# EAGLE design xcodec_CS42526_A (EAGLE 8.2.0)
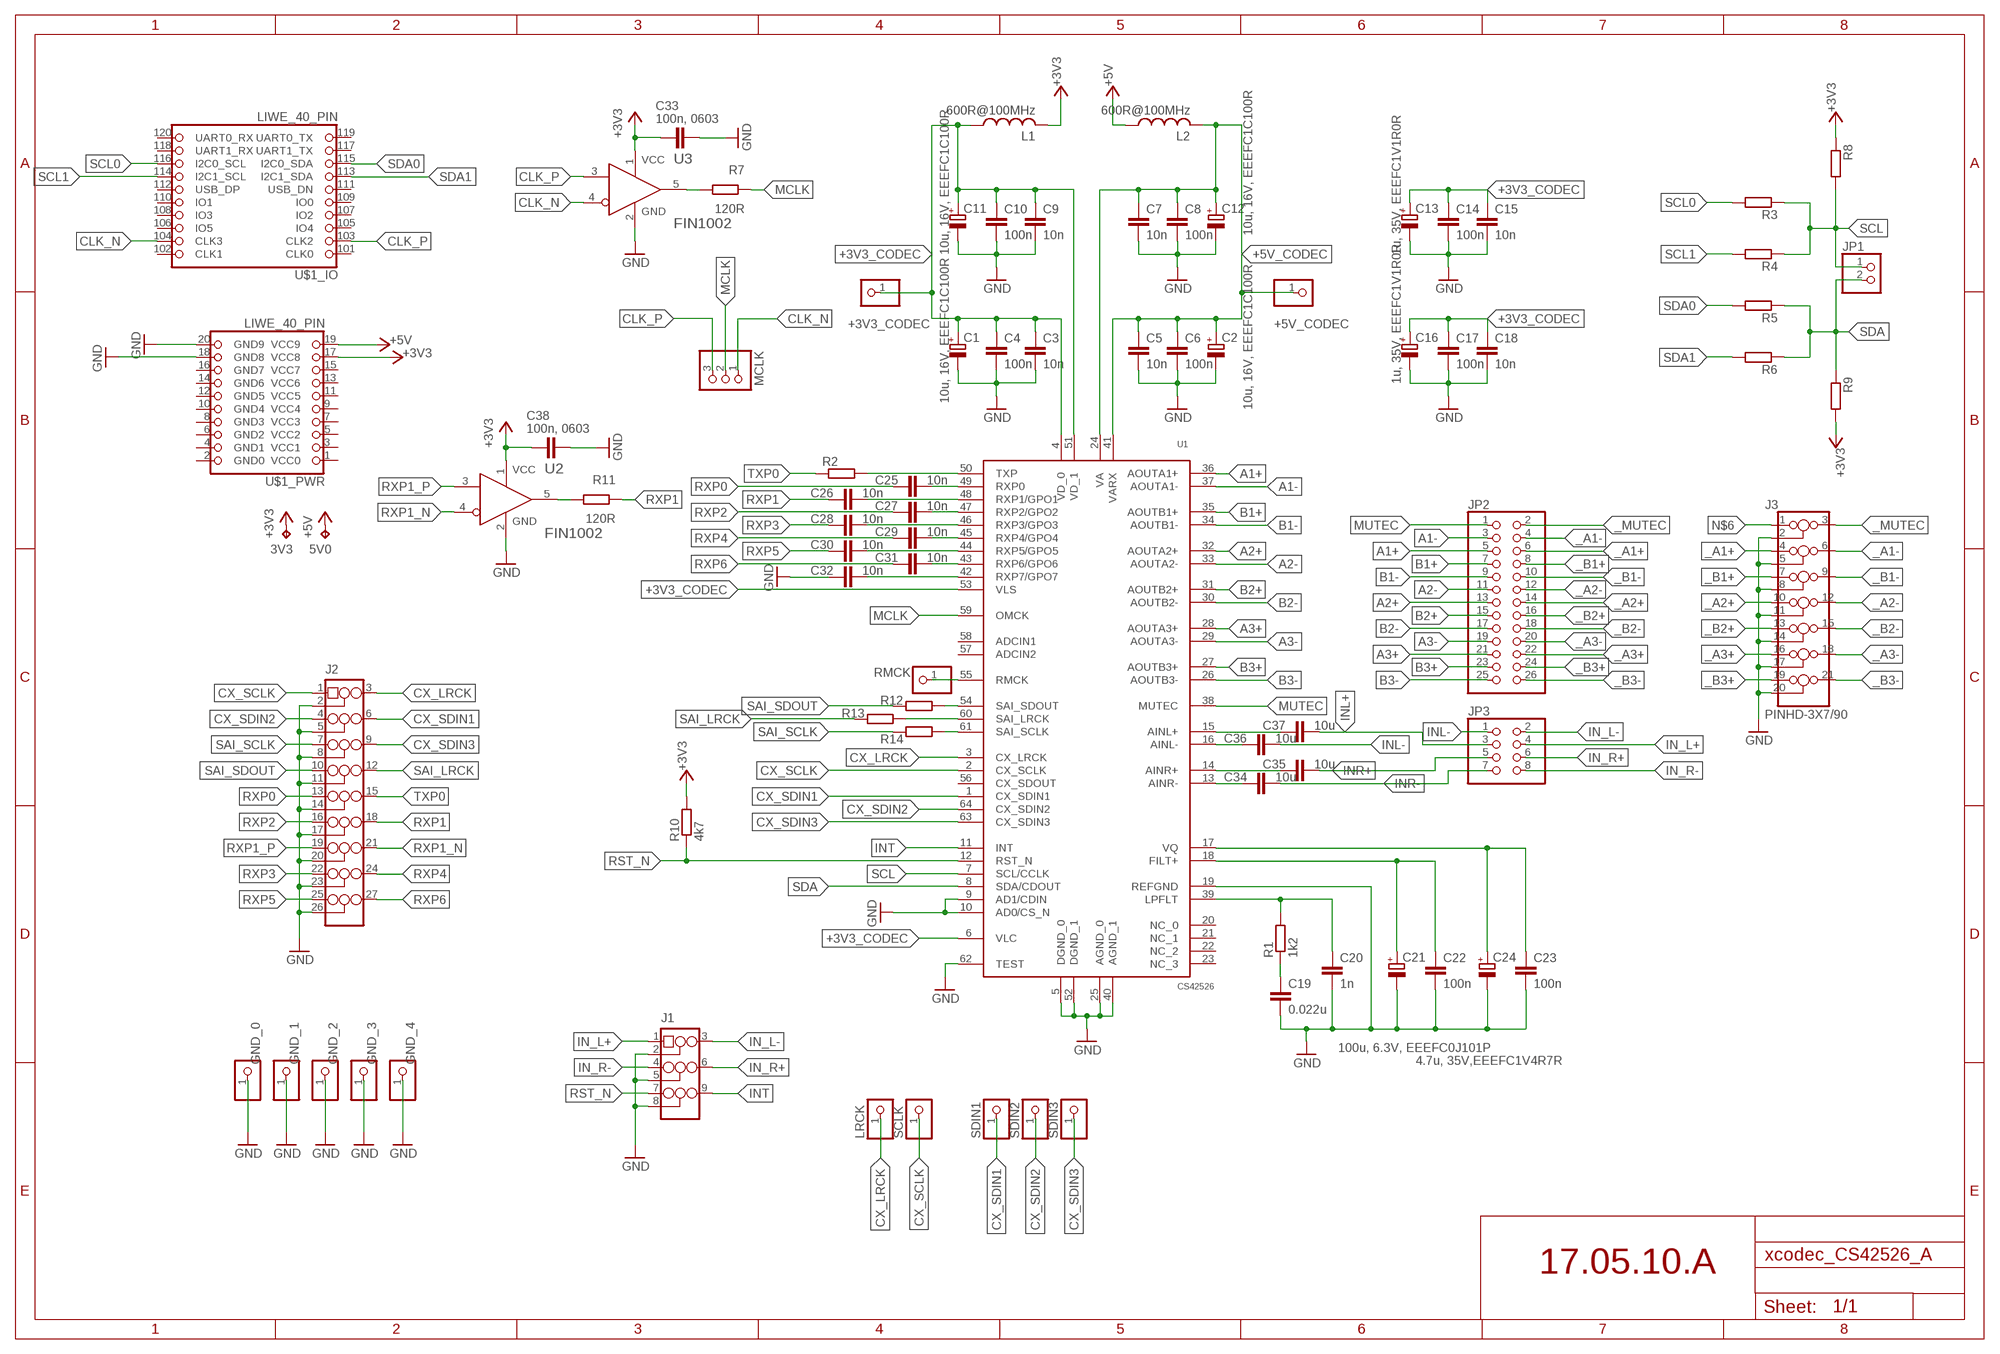
[diagram p0: schematic, sheet 1]

## Parts
3V3  TPTP14R  [TP14R]
5V0  TPTP14R  [TP14R]
+3V3_CODEC  PINHD-1X1  [1X01]
+5V_CODEC  PINHD-1X1  [1X01]
C1  10u, 16V, EEEFC1C100R  C-POL_B  [EEE-FC1V1R0AR]
C2  10u, 16V, EEEFC1C100R  C-POL_B  [EEE-FC1V1R0AR]
C3  10n  C-EUC0603K  [C0603K]
C4  100n  C-EUC0603K  [C0603K]
C5  10n  C-EUC0603K  [C0603K]
C6  100n  C-EUC0603K  [C0603K]
C7  10n  C-EUC0603K  [C0603K]
C8  100n  C-EUC0603K  [C0603K]
C9  10n  C-EUC0603K  [C0603K]
C10  100n  C-EUC0603K  [C0603K]
C11  10u, 16V, EEEFC1C100R  C-POL_B  [EEE-FC1V1R0AR]
C12  10u, 16V, EEEFC1C100R  C-POL_B  [EEE-FC1V1R0AR]
C13  1u, 35V, EEEFC1V1R0R  C-POL_B  [EEE-FC1V1R0AR]
C14  100n  C-EUC0603K  [C0603K]
C15  10n  C-EUC0603K  [C0603K]
C16  1u, 35V, EEEFC1V1R0R  C-POL_B  [EEE-FC1V1R0AR]
C17  100n  C-EUC0603K  [C0603K]
C18  10n  C-EUC0603K  [C0603K]
C19  0.022u  C-EUC0603K  [C0603K]
C20  1n  C-EUC0603K  [C0603K]
C21  100u, 6.3V, EEEFC0J101P  C-POL_D  [EEE-FC1V220P]
C22  100n  C-EUC0603K  [C0603K]
C23  100n  C-EUC0603K  [C0603K]
C24  4.7u, 35V,EEEFC1V4R7R  C-POL_B  [EEE-FC1V1R0AR]
C25  10n  C-EUC0603K  [C0603K]
C26  10n  C-EUC0603K  [C0603K]
C27  10n  C-EUC0603K  [C0603K]
C28  10n  C-EUC0603K  [C0603K]
C29  10n  C-EUC0603K  [C0603K]
C30  10n  C-EUC0603K  [C0603K]
C31  10n  C-EUC0603K  [C0603K]
C32  10n  C-EUC0603K  [C0603K]
C33  100n, 0603  C-EUC0603K  [C0603K]
C34  10u  C-EUC0603K  [C0603K]
C35  10u  C-EUC0603K  [C0603K]
C36  10u  C-EUC0603K  [C0603K]
C37  10u  C-EUC0603K  [C0603K]
C38  100n, 0603  C-EUC0603K  [C0603K]
GND_0  PINHD-1X1  [1X01]
GND_1  PINHD-1X1  [1X01]
GND_2  PINHD-1X1  [1X01]
GND_3  PINHD-1X1  [1X01]
GND_4  PINHD-1X1  [1X01]
J1  PINHD-3X3/90  [3X03/90]
J2  PINHD-3X9/90  [3X9/90]
J3  PINHD-3X7/90  [3X07/90]
JP1  PINHD-1X2  [1X02]
JP2  PINHD-2X13  [2X13]
JP3  PINHD-2X4  [2X04]
L1  600R@100MHz  L0603(1608)  [L0603]
L2  600R@100MHz  L0603(1608)  [L0603]
LRCK  PINHD-1X1  [1X01]
MCLK  PINHD-1X3  [1X03]
R1  1k2  R-EU_R0603  [R0603]
R2  R-EU_R0603  [R0603]
R3  R-EU_R0603  [R0603]
R4  R-EU_R0603  [R0603]
R5  R-EU_R0603  [R0603]
R6  R-EU_R0603  [R0603]
R7  120R  R-EU_R0603  [R0603]
R8  R-EU_R0603  [R0603]
R9  R-EU_R0603  [R0603]
R10  4k7  R-EU_R0603  [R0603]
R11  120R  R-EU_R0603  [R0603]
R12  R-EU_R0603  [R0603]
R13  R-EU_R0603  [R0603]
R14  R-EU_R0603  [R0603]
RMCK  PINHD-1X1  [1X01]
SCLK  PINHD-1X1  [1X01]
SDIN1  PINHD-1X1  [1X01]
SDIN2  PINHD-1X1  [1X01]
SDIN3  PINHD-1X1  [1X01]
U1  CS42526  [LQFP_64]
U2  FIN1002  [SOT95P280X140-5N]
U3  FIN1002  [SOT95P280X140-5N]
U$1  LIWE_40_PIN  [LIWE_40_PIN_8X8]

## Nets
+3V3: 3V3.TP C33.2 C38.2 L1.2 R8.1 R9.2 R10.2 U2.1(VCC) U3.1(VCC) U$1.17(_PWR:VCC8)
+3V3_CODEC: +3V3_CODEC.1 C1.1(+) C3.1 C4.1 C9.1 C10.1 C11.1(+) C13.1(+) C14.1 C15.1 C16.1(+) C17.1 C18.1 L1.1 U1.4(VD_0) U1.6(VLC) U1.51(VD_1) U1.53(VLS)
+5V: 5V0.TP L2.1 U$1.19(_PWR:VCC9)
+5V_CODEC: +5V_CODEC.1 C2.1(+) C5.1 C6.1 C7.1 C8.1 C12.1(+) L2.2 U1.24(VA) U1.41(VARX)
_A1+: J3.4 JP2.6
_A1-: J3.6 JP2.4
_A2+: J3.10 JP2.14
_A2-: J3.12 JP2.12
_A3+: J3.16 JP2.22
_A3-: J3.18 JP2.20
_B1+: J3.7 JP2.8
_B1-: J3.9 JP2.10
_B2+: J3.13 JP2.16
_B2-: J3.15 JP2.18
_B3+: J3.19 JP2.24
_B3-: J3.21 JP2.26
_MUTEC: J3.3 JP2.2
A1+: JP2.5 U1.36(AOUTA1+)
A1-: JP2.3 U1.37(AOUTA1-)
A2+: JP2.13 U1.32(AOUTA2+)
A2-: JP2.11 U1.33(AOUTA2-)
A3+: JP2.21 U1.28(AOUTA3+)
A3-: JP2.19 U1.29(AOUTA3-)
B1+: JP2.7 U1.35(AOUTB1+)
B1-: JP2.9 U1.34(AOUTB1-)
B2+: JP2.15 U1.31(AOUTB2+)
B2-: JP2.17 U1.30(AOUTB2-)
B3+: JP2.23 U1.27(AOUTB3+)
B3-: JP2.25 U1.26(AOUTB3-)
CLK_N: MCLK.1 U3.4(RIN-) U$1.104(_IO:CLK3)
CLK_P: MCLK.3 U3.3(RIN+) U$1.103(_IO:CLK2)
CX_LRCK: J2.3 LRCK.1 U1.3(CX_LRCK)
CX_SCLK: J2.1 SCLK.1 U1.2(CX_SCLK)
CX_SDIN1: J2.6 SDIN1.1 U1.1(CX_SDIN1)
CX_SDIN2: J2.4 SDIN2.1 U1.64(CX_SDIN2)
CX_SDIN3: J2.9 SDIN3.1 U1.63(CX_SDIN3)
FILT+: C21.1(+) C22.1 U1.18(FILT+)
GND: C1.2(-) C2.2(-) C3.2 C4.2 C5.2 C6.2 C7.2 C8.2 C9.2 C10.2 C11.2(-) C12.2(-) C13.2(-) C14.2 C15.2 C16.2(-) C17.2 C18.2 C19.2 C20.2 C21.2(-) C22.2 C23.2 C24.2(-) C32.1 C33.1 C38.1 GND_0.1 GND_1.1 GND_2.1 GND_3.1 GND_4.1 J1.2 J1.5 J1.8 J2.2 J2.5 J2.8 J2.11 J2.14 J2.17 J2.20 J2.23 J2.26 J3.2 J3.5 J3.8 J3.11 J3.14 J3.17 J3.20 U1.5(DGND_0) U1.9(AD1/CDIN) U1.10(AD0/CS_N) U1.19(REFGND) U1.25(AGND_0) U1.40(AGND_1) U1.52(DGND_1) U1.62(TEST) U2.2(GND) U3.2(GND) U$1.18(_PWR:GND8) U$1.20(_PWR:GND9)
IN_L+: J1.1 JP3.4
IN_L-: J1.3 JP3.2
IN_R+: J1.6 JP3.6
IN_R-: J1.4 JP3.8
INL+: C37.2 JP3.3
INL-: C36.2 JP3.1
INR+: C35.2 JP3.5
INR-: C34.2 JP3.7
INT: J1.9 U1.11(INT)
LPFLT: C20.1 R1.2 U1.39(LPFLT)
MCLK: MCLK.2 R7.1 U1.59(OMCK)
MUTEC: JP2.1 U1.38(MUTEC)
N$1: R12.1 U1.54(SAI_SDOUT)
N$2: R11.2 U2.5(ROUT)
N$3: C19.1 R1.1
N$4: R13.1 U1.60(SAI_LRCK)
N$5: R14.1 U1.61(SAI_SCLK)
N$6: J3.1
N$7: R7.2 U3.5(ROUT)
N$16: C37.1 U1.15(AINL+)
N$17: C36.1 U1.16(AINL-)
N$18: C35.1 U1.14(AINR+)
N$19: C34.1 U1.13(AINR-)
RMCK: RMCK.1 U1.55(RMCK)
RP0: C25.2 U1.49(RXP0)
RP1: C26.2 U1.48(RXP1/GPO1)
RP2: C27.2 U1.47(RXP2/GPO2)
RP3: C28.2 U1.46(RXP3/GPO3)
RP4: C29.2 U1.45(RXP4/GPO4)
RP5: C30.2 U1.44(RXP5/GPO5)
RP6: C31.2 U1.43(RXP6/GPO6)
RP7: C32.2 U1.42(RXP7/GPO7)
RST_N: J1.7 R10.1 U1.12(RST_N)
RXP0: C25.1 J2.13
RXP1: C26.1 J2.18 R11.1
RXP1_N: J2.21 U2.4(RIN-)
RXP1_P: J2.19 U2.3(RIN+)
RXP2: C27.1 J2.16
RXP3: C28.1 J2.22
RXP4: C29.1 J2.24
RXP5: C30.1 J2.25
RXP6: C31.1 J2.27
SAI_LRCK: J2.12 R13.2
SAI_SCLK: J2.7 R14.2
SAI_SDOUT: J2.10 R12.2
SCL: JP1.1 R3.1 R4.1 R8.2 U1.7(SCL/CCLK)
SCL0: R3.2 U$1.116(_IO:I2C0_SCL)
SCL1: R4.2 U$1.114(_IO:I2C1_SCL)
SDA: JP1.2 R5.1 R6.1 R9.1 U1.8(SDA/CDOUT)
SDA0: R5.2 U$1.115(_IO:I2C0_SDA)
SDA1: R6.2 U$1.113(_IO:I2C1_SDA)
TP0: R2.2 U1.50(TXP)
TXP0: J2.15 R2.1
VQ: C23.1 C24.1(+) U1.17(VQ)
Unconnected: U1.20(NC_0) U1.21(NC_1) U1.22(NC_2) U1.23(NC_3) U1.56(CX_SDOUT) U1.57(ADCIN2) U1.58(ADCIN1) U$1.1(_PWR:VCC0) U$1.2(_PWR:GND0) U$1.3(_PWR:VCC1) U$1.4(_PWR:GND1) U$1.5(_PWR:VCC2) U$1.6(_PWR:GND2) U$1.7(_PWR:VCC3) U$1.8(_PWR:GND3) U$1.9(_PWR:VCC4) U$1.10(_PWR:GND4) U$1.11(_PWR:VCC5) U$1.12(_PWR:GND5) U$1.13(_PWR:VCC6) U$1.14(_PWR:GND6) U$1.15(_PWR:VCC7) U$1.16(_PWR:GND7) U$1.101(_IO:CLK0) U$1.102(_IO:CLK1) U$1.105(_IO:IO4) U$1.106(_IO:IO5) U$1.107(_IO:IO2) U$1.108(_IO:IO3) U$1.109(_IO:IO0) U$1.110(_IO:IO1) U$1.111(_IO:USB_DN) U$1.112(_IO:USB_DP) U$1.117(_IO:UART1_TX) U$1.118(_IO:UART1_RX) U$1.119(_IO:UART0_TX) U$1.120(_IO:UART0_RX)

## Notes on the sheet
- 17.05.10.A

## Library data of the parts
3V3 5V0 = testpad:TP: Test pad
+3V3_CODEC +5V_CODEC GND_0 GND_1-GND_4 LRCK RMCK SCLK SDIN1-SDIN3 = 25pinhead:PINHD-1X1: PIN HEADER
C1 C2 C11-C13 C16 C21 C24 = 25cmsquare:C-POL: Panasonic Alluminium Electrolytic Capacitors / FC Series: FC Type: V http://www.farnell.com/datasheets/2059994.pdf?_ga=1.187970088.1293831445.1473845555
C3-C10 C14 C15 C17-C20 C22 C23 C25-C38 = rcl:C-EU: CAPACITOR, European symbol
J1 = 25pinhead:PINHD-3X3
J2 = 25pinhead:PINHD-3X9
J3 = 25pinhead:PINHD-3X7
JP1 = 25pinhead:PINHD-1X2: PIN HEADER
JP2 = 25pinhead:PINHD-2X13: PIN HEADER
JP3 = 25pinhead:PINHD-2X4: PIN HEADER
L1 L2 = 25cmsquare:L
MCLK = 25pinhead:PINHD-1X3: PIN HEADER
R1-R14 = rcl:R-EU_: RESISTOR, European symbol
U1 = 25cmsquare:CS42526
U2 U3 = 25cmsquare:FIN1002
U$1 = 25cmsquare:LIWE_40_PIN

## Board
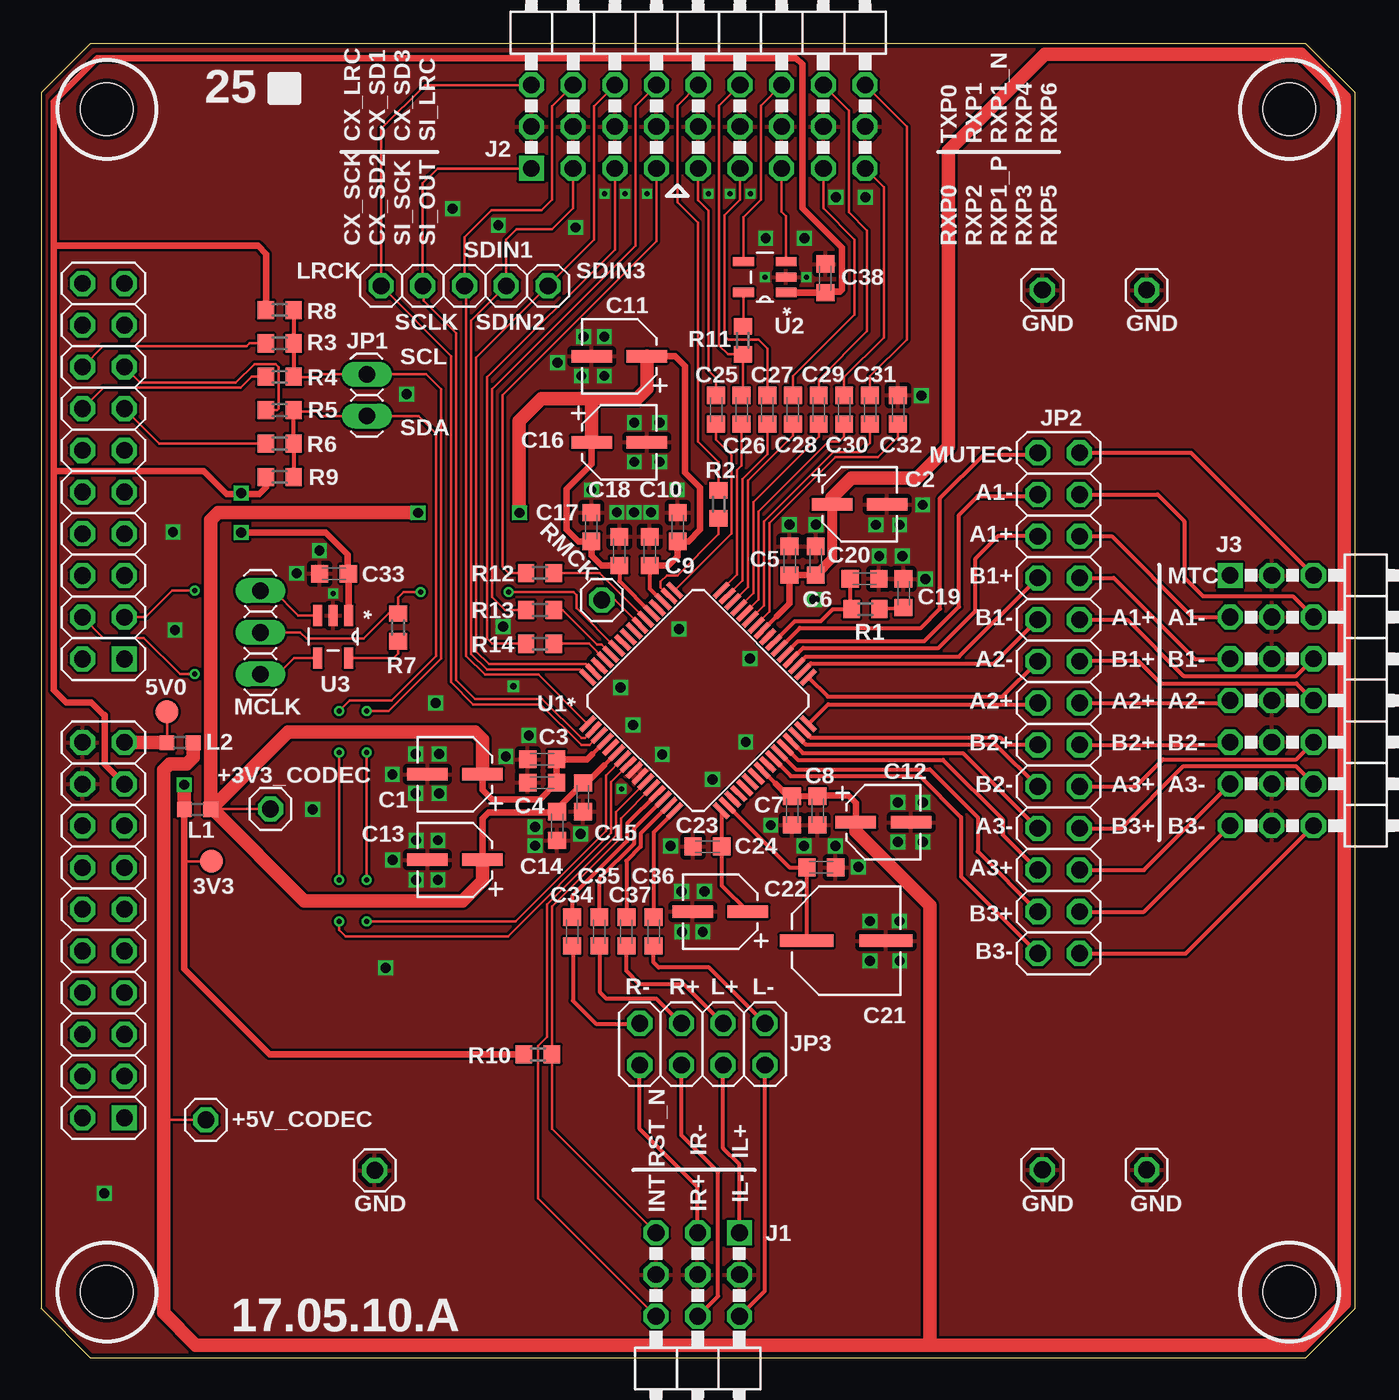
[diagram p1: board, top side]
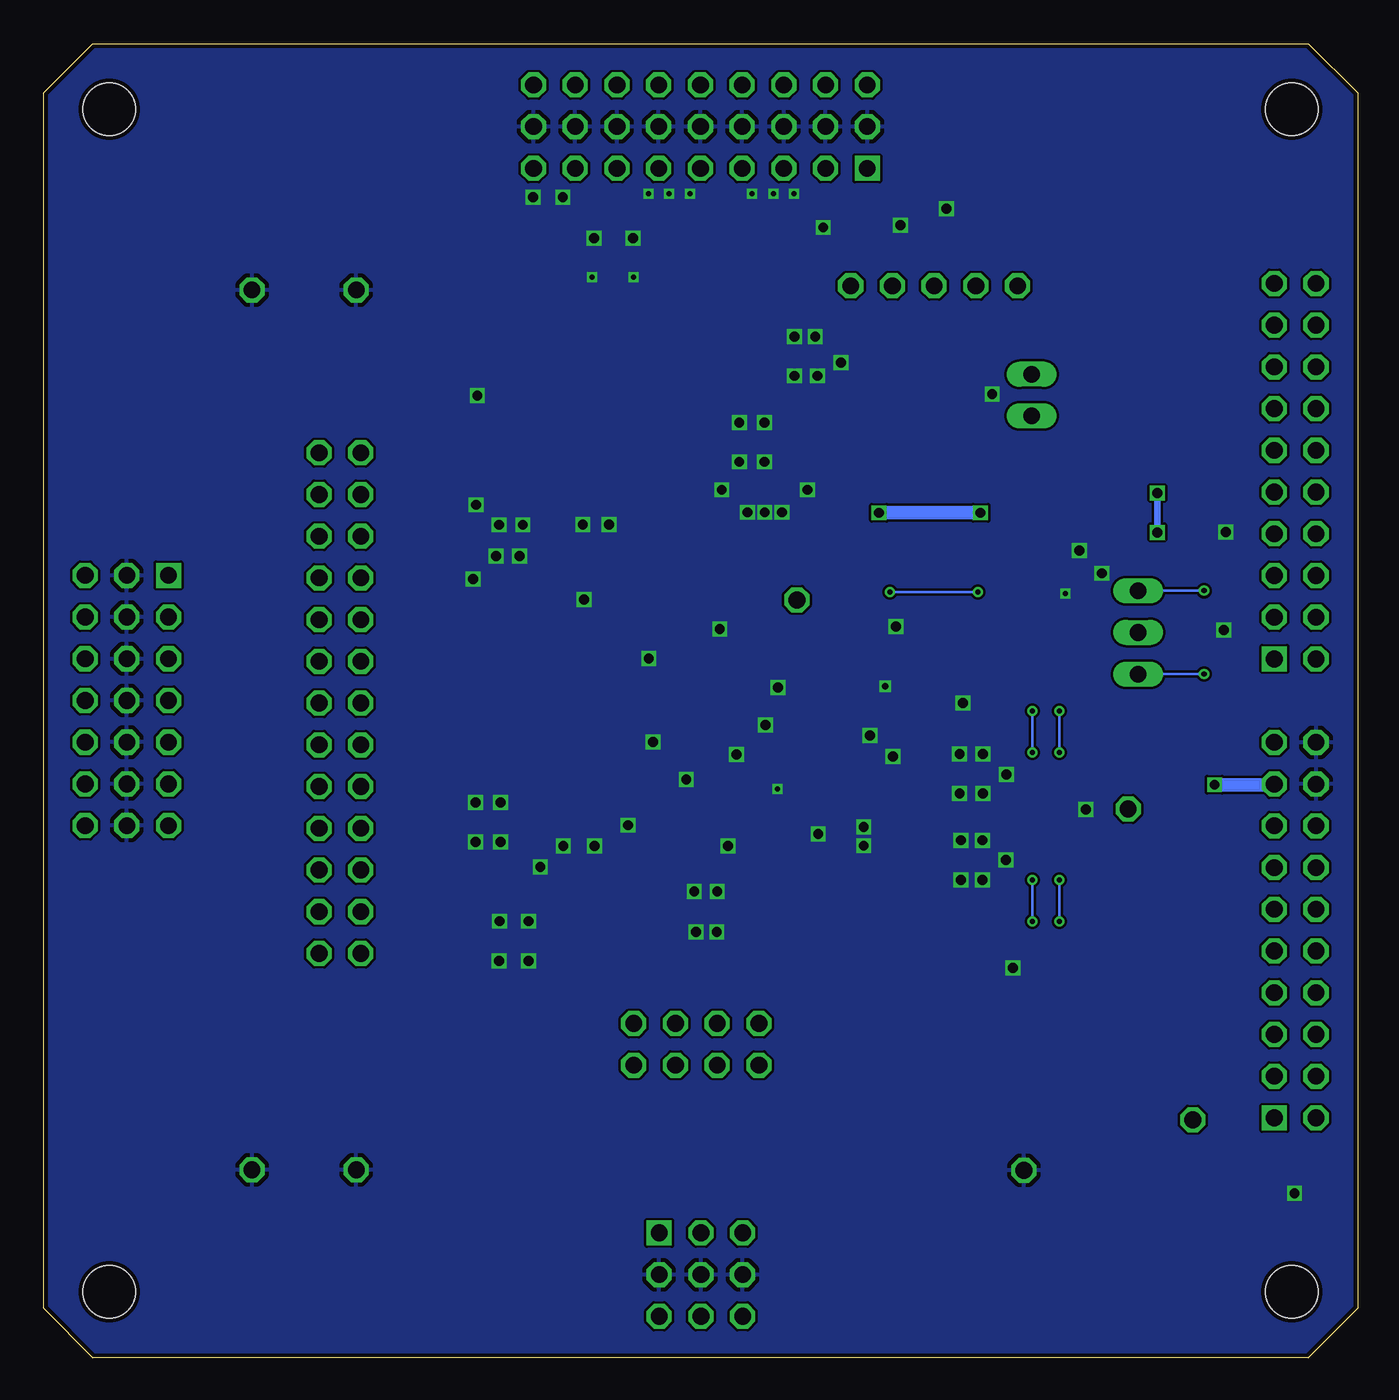
[diagram p2: board, bottom side, seen from below]

Size 80 x 80 mm. Coordinates in mm from the lower left corner, seen from the top.
Copper layers (1*16): Top 0.035mm / dielectric 1.5mm / Bottom 0.035mm
Design rules "SeeedStudio_2layer_DRU_no_angle_20140221": minimum track width 6mil, minimum drill 12mil, track to track 6mil, track to pad 6mil, pad to pad 6mil, via to via 6mil, smd to smd 0mil, copper to edge 10mil, drill to drill 10mil, minimum pad ring 10mil, minimum via ring 6mil, stop-mask expansion 2mil, vias tented up to drill 100mil, thermal gap 10mil

### Footprints (pad centres in the part's own frame; a part is rotated, then mirrored left to right if it is on the bottom)
TP14R = smd 1.4 x 1.4: TP 0,0
1X01 = drill 1.016 octagon: 1 0,0
EEE-FC1V1R0AR = smd 2.464 x 0.762: 1 -1.676,0; 2 1.676,0
C0603K = smd 1.05 x 1.08: 1 -0.875,0; 2 0.875,0
EEE-FC1V220P = smd 3.251 x 0.762: 1 -2.413,0; 2 2.413,0
3X03/90 = drill 1.016 square: 1 -2.54,-7.62 | drill 1.016 octagon: 2 -2.54,-5.08; 3 -2.54,-2.54; 4 0,-7.62; 5 0,-5.08; 6 0,-2.54; 7 2.54,-7.62; 8 2.54,-5.08; 9 2.54,-2.54
3X9/90 = drill 1.016 square: 1 -10.16,-7.62 | drill 1.016 octagon: 2 -10.16,-5.08; 3 -10.16,-2.54; 4 -7.62,-7.62; 5 -7.62,-5.08; 6 -7.62,-2.54; 7 -5.08,-7.62; 8 -5.08,-5.08; 9 -5.08,-2.54; 10 -2.54,-7.62; 11 -2.54,-5.08; 12 -2.54,-2.54; 13 0,-7.62; 14 0,-5.08; 15 0,-2.54; 16 2.54,-7.62; 17 2.54,-5.08; 18 2.54,-2.54; 19 5.08,-7.62; 20 5.08,-5.08; 21 5.08,-2.54; 22 7.62,-7.62; 23 7.62,-5.08; 24 7.62,-2.54; 25 10.16,-7.62; 26 10.16,-5.08; 27 10.16,-2.54
3X07/90 = drill 1.016 square: 1 -7.62,-8.89 | drill 1.016 octagon: 2 -7.62,-6.35; 3 -7.62,-3.81; 4 -5.08,-8.89; 5 -5.08,-6.35; 6 -5.08,-3.81; 7 -2.54,-8.89; 8 -2.54,-6.35; 9 -2.54,-3.81; 10 0,-8.89; 11 0,-6.35; 12 0,-3.81; 13 2.54,-8.89; 14 2.54,-6.35; 15 2.54,-3.81; 16 5.08,-8.89; 17 5.08,-6.35; 18 5.08,-3.81; 19 7.62,-8.89; 20 7.62,-6.35; 21 7.62,-3.81
1X02 = drill 1.016 long: 1 -1.27,0; 2 1.27,0
2X13 = drill 1.016 octagon: 1 -15.24,-1.27; 2 -15.24,1.27; 3 -12.7,-1.27; 4 -12.7,1.27; 5 -10.16,-1.27; 6 -10.16,1.27; 7 -7.62,-1.27; 8 -7.62,1.27; 9 -5.08,-1.27; 10 -5.08,1.27; 11 -2.54,-1.27; 12 -2.54,1.27; 13 0,-1.27; 14 0,1.27; 15 2.54,-1.27; 16 2.54,1.27; 17 5.08,-1.27; 18 5.08,1.27; 19 7.62,-1.27; 20 7.62,1.27; 21 10.16,-1.27; 22 10.16,1.27; 23 12.7,-1.27; 24 12.7,1.27; 25 15.24,-1.27; 26 15.24,1.27
2X04 = drill 1.016 octagon: 1 -3.81,-1.27; 2 -3.81,1.27; 3 -1.27,-1.27; 4 -1.27,1.27; 5 1.27,-1.27; 6 1.27,1.27; 7 3.81,-1.27; 8 3.81,1.27
L0603 = smd 0.9 x 0.9: 1 -0.8,0; 2 0.8,0
1X03 = drill 1.016 long: 1 -2.54,0; 2 0,0; 3 2.54,0
R0603 = smd 1 x 1.1: 1 -0.85,0; 2 0.85,0
LQFP_64 = smd 1.2 x 0.3: 1 -5.75,3.75; 2 -5.75,3.25; 3 -5.75,2.75; 4 -5.75,2.25; 5 -5.75,1.75; 6 -5.75,1.25; 7 -5.75,0.75; 8 -5.75,0.25; 9 -5.75,-0.25; 10 -5.75,-0.75; 11 -5.75,-1.25; 12 -5.75,-1.75; 13 -5.75,-2.25; 14 -5.75,-2.75; 15 -5.75,-3.25; 16 -5.75,-3.75; 33 5.75,-3.75; 34 5.75,-3.25; 35 5.75,-2.75; 36 5.75,-2.25; 37 5.75,-1.75; 38 5.75,-1.25; 39 5.75,-0.75; 40 5.75,-0.25; 41 5.75,0.25; 42 5.75,0.75; 43 5.75,1.25; 44 5.75,1.75; 45 5.75,2.25; 46 5.75,2.75; 47 5.75,3.25; 48 5.75,3.75 | smd 0.3 x 1.2: 17 -3.75,-5.75; 18 -3.25,-5.75; 19 -2.75,-5.75; 20 -2.25,-5.75; 21 -1.75,-5.75; 22 -1.25,-5.75; 23 -0.75,-5.75; 24 -0.25,-5.75; 25 0.25,-5.75; 26 0.75,-5.75; 27 1.25,-5.75; 28 1.75,-5.75; 29 2.25,-5.75; 30 2.75,-5.75; 31 3.25,-5.75; 32 3.75,-5.75; 49 3.75,5.75; 50 3.25,5.75; 51 2.75,5.75; 52 2.25,5.75; 53 1.75,5.75; 54 1.25,5.75; 55 0.75,5.75; 56 0.25,5.75; 57 -0.25,5.75; 58 -0.75,5.75; 59 -1.25,5.75; 60 -1.75,5.75; 61 -2.25,5.75; 62 -2.75,5.75; 63 -3.25,5.75; 64 -3.75,5.75
SOT95P280X140-5N = smd 1.27 x 0.559: 1 -1.295,0.94; 2 -1.295,0; 3 -1.295,-0.94; 4 1.295,-0.94; 5 1.295,0.94
LIWE_40_PIN_8X8 = drill 1.016 square: 1 74.93,65.405; 101 74.93,37.465 | drill 1.016 octagon: 2 77.47,65.405; 3 74.93,62.865; 4 77.47,62.865; 5 74.93,60.325; 6 77.47,60.325; 7 74.93,57.785; 8 77.47,57.785; 9 74.93,55.245; 10 77.47,55.245; 11 74.93,52.705; 12 77.47,52.705; 13 74.93,50.165; 14 77.47,50.165; 15 74.93,47.625; 16 77.47,47.625; 17 74.93,45.085; 18 77.47,45.085; 19 74.93,42.545; 20 77.47,42.545; 102 77.47,37.465; 103 74.93,34.925; 104 77.47,34.925; 105 74.93,32.385; 106 77.47,32.385; 107 74.93,29.845; 108 77.47,29.845; 109 74.93,27.305; 110 77.47,27.305; 111 74.93,24.765; 112 77.47,24.765; 113 74.93,22.225; 114 77.47,22.225; 115 74.93,19.685; 116 77.47,19.685; 117 74.93,17.145; 118 77.47,17.145; 119 74.93,14.605; 120 77.47,14.605 | hole 3.2: 4,76; 4,4; 76,4; 76,76

### Placement (x,y rotation side)
3V3  10.38,30.23 90 top
5V0  7.66,39.31 90 top
+3V3_CODEC  13.97,33.4 0 top
+5V_CODEC  10.03,14.48 0 top
C1  25.2,35.51 180 top
C2  49.83,51.94 0 top
C3  30.51,36.42 180 top
C4  30.51,35 180 top
C5  45.57,48.51 90 top
C6  47.17,48.51 90 top
C7  45.72,33.3 270 top
C8  47.27,33.3 270 top
C9  37.06,49.1 90 top
C10  38.76,50.57 90 top
C11  35.2,60.96 180 top
C12  51.28,32.59 0 top
C13  25.2,30.3 180 top
C14  31.42,32.36 270 top
C15  32.99,34.11 270 top
C16  35.2,55.73 0 top
C17  33.5,50.57 90 top
C18  35.2,49.1 90 top
C19  52.5,46.53 90 top
C20  50.14,47.42 0 top
C21  49.02,25.37 0 top
C22  47.5,29.84 0 top
C23  40.56,31.11 180 top
C24  41.35,27.15 180 top
C25  41.1,57.71 270 top
C26  42.65,57.71 270 top
C27  44.22,57.71 270 top
C28  45.77,57.71 270 top
C29  47.35,57.71 270 top
C30  48.9,57.71 270 top
C31  50.47,57.71 270 top
C32  52.17,57.71 270 top
C33  17.83,47.73 0 top
C34  32.33,25.93 270 top
C35  33.99,25.93 270 top
C36  37.29,25.93 270 top
C37  35.64,25.93 270 top
C38  47.75,65.71 270 top
GND_0  60.96,11.43 0 top
GND_1  67.31,11.43 0 top
GND_2  67.31,65 0 top
GND_3  60.96,65 0 top
GND_4  20.32,11.4 0 top
J1  39.98,-0.03 180 top
J2  40.01,80.03 0 top
J3  81.28,40.01 270 top
JP1  19.84,58.6 270 top
JP2  61.96,39.85 270 top
JP3  40.26,19.08 180 top
L1  9.53,33.38 180 top
L2  8.46,37.44 0 top
LRCK  20.7,65.25 0 top
MCLK  13.36,44.15 90 top
R1  50.19,45.57 180 top
R2  41.25,51.94 270 top
R3  14.53,61.75 180 top
R4  14.53,59.72 180 top
R5  14.53,57.68 180 top
R6  14.53,55.65 180 top
R7  21.74,44.45 270 top
R8  14.53,63.78 0 top
R9  14.53,53.62 180 top
R10  30.25,18.47 180 top
R11  42.72,61.93 90 top
R12  30.38,47.78 180 top
R13  30.38,45.52 180 top
R14  30.38,43.46 180 top
RMCK  34.14,46.13 0 top
SCLK  23.24,65.25 0 top
SDIN1  25.78,65.25 0 top
SDIN2  28.32,65.25 0 top
SDIN3  30.86,65.25 0 top
U1  40,40 45 top
U2  44.07,65.79 180 top
U3  17.78,43.89 270 top
U$1  80,80 180 top

### Tracks (layer width: path | path; a pad name or v marks a point on that pad's centre or on a via)
+3V3  (via drill 0.6)
  Top 0.152: L1.2 8.74,33.36 | 3V3.TP 10.36,30.2 8.72,30.2
  Top 0.406: U$1.17 3.86,36.12 3.86,39.12 3.81,39.12 3.05,39.88 1.52,39.88 0.76,40.64 0.76,53.98 | U2.1 45.38,64.83 C38.2 47.81,64.9 48.64,64.9 48.77,65.02 48.77,67.56 46.35,69.98 46.35,78.74 45.97,79.12 3.43,79.12 0.76,76.45 0.76,67.69 | 0.76,67.69 13.21,67.69 13.72,67.18 13.72,63.82 R8.1 | 0.76,53.98 9.91,53.98 11.3,52.58 12.25,52.58 | 13.72,53.58 R9.2 | U3.1 18.72,47.71 C33.2 18.67,47.76 18.67,48.9 17.33,50.24 v12.19,50.24 | 0.76,53.98 0.76,67.69 | 12.25,52.58 13.28,52.58 13.72,53.01 13.72,53.58 | 12.25,52.58 v12.19,52.63 | L1.2 8.72,30.2 8.72,23.66 13.92,18.47 R10.2 | 13.72,53.58 13.72,53.36
  Top 0.813: L1.2 8.71,34.24 v8.71,34.87
  Bottom 0.406: v12.19,52.63 v12.19,50.24
  Bottom 0.813: v8.71,34.87 5.11,34.87 U$1.17
+3V3_CODEC  (via drill 0.6)
  Top 0.152: +3V3_CODEC.1 10.32,33.4 10.31,33.39
  Top 0.254: U1.53 35.2,47.27 C18.1 | U1.51 37.06,46.83 C9.1 | 33.05,34.81 C15.1 33.22,34.99 | 33.76,49.67 C17.1 | 31.38,35.31 C4.1 | U1.4 33.55,36.73 | U1.6 34.27,36.03
  Top 0.406: 38.51,49.67 C10.1 | C1.1 26.87,34.57 27.46,33.98 30.36,33.98 C4.1 C3.1 33.24,36.42 33.55,36.73 | C15.1 31.42,33.41 C14.1 31.38,33.2 27.25,33.2 26.87,32.82 C13.1 | 34.27,36.03 33.22,34.99 | C16.1 33.53,54.41 32,52.88 32,50.42 32.73,49.7 C17.1 33.53,49.67 33.53,48.82 34.12,48.22 C18.1 | C11.1 38.61,60.96 39.22,60.35 39.22,53.87 40.13,52.96 40.13,50.42 39.41,49.7 C10.1 | C10.1 38.73,49.67 38.73,48.77 38.19,48.22 C9.1
  Top 0.813: L1.1 10.31,33.39 10.31,50.98 10.77,51.44 v22.96,51.44 | L1.1 10.46,33.38 16.03,27.81 25.65,27.81 26.87,29.03 C13.1 | v29.13,51.44 29.11,51.46 29.11,57.02 30.48,58.4 33.53,58.4 | C11.1 36.88,58.98 36.3,58.4 33.53,58.4 | C16.1 33.53,58.4 | C1.1 26.87,37.64 26.42,38.1 15.05,38.1 L1.1
  Bottom 0.813: v22.96,51.44 v29.13,51.44
+5V
  Top 0.152: L2.1 5V0.TP
  Top 0.813: U$1.19 7.64,37.45 L2.1
+5V_CODEC
  Top 0.152: +5V_CODEC.1 7.46,14.48
  Top 0.254: U1.41 44.8,45.15 | 44.73,34.91 U1.24
  Top 0.406: C12.1 49.61,33.76 49.15,34.21 47.28,34.21 C8.1 45.74,34.2 C7.1 45.47,34.17 44.73,34.91 | C6.1 C5.1 45.57,45.92 44.8,45.15
  Top 0.61: C2.1 48.16,50.11 48.16,50.1 48.16,48.64 C6.1
  Top 0.813: 54.1,0.76 9.42,0.76 7.46,2.73 7.46,14.48 7.46,35.78 7.82,36.14 8.87,36.14 9.26,36.54 L2.2 | 54.1,0.76 76.83,0.76 79.34,3.27 79.34,76.73 76.73,79.34 61.11,79.34 55.24,73.47 55.24,55.47 53.31,53.54 49.33,53.54 48.16,52.38 C2.1 | 54.1,0.76 54.1,27.53 49.61,32.03 C12.1
_A1+
  Top 0.254: JP2.6 65.18,50.01 70.1,45.09 J3.4
_A1-
  Top 0.254: JP2.4 67.97,52.55 69.6,50.93 69.6,47.5 70.74,46.35 76.2,46.35 J3.6
_A2+
  Top 0.254: JP2.14 72.23,39.85 J3.10
_A2-
  Top 0.254: JP2.12 63.26,42.42 66.8,42.42 68.17,41.05 76.43,41.05 J3.12
_A3+
  Top 0.254: JP2.22 67.15,29.69 J3.16
_A3-
  Top 0.254: JP2.20 65.76,32.23 69.55,36.02 76.38,36.02 J3.18
_B1+
  Top 0.254: JP2.8 65.31,47.47 70.23,42.55 J3.7
_B1-
  Top 0.254: J3.9 76.43,41.5 69.56,41.5 66.13,44.93 JP2.10
_B2+
  Top 0.254: JP2.16 72.23,37.31 J3.13
_B2-
  Top 0.254: JP2.18 66.64,34.77 68.3,36.42 76.43,36.42 J3.15
_B3+
  Top 0.254: JP2.24 67.15,27.15 J3.19
_B3-
  Top 0.254: JP2.26 69.69,24.61 J3.21
_MUTEC
  Top 0.254: JP2.2 70.01,55.09 J3.3
A1+
  Top 0.254: U1.36 46.39,43.2 54.63,43.2 56.9,45.47 56.9,48.64 58.29,50.04 60.66,50.04 JP2.5
A1-
  Top 0.254: U1.37 46.09,43.61 53.77,43.61 55.88,45.72 55.88,51.31 57.02,52.45 60.59,52.45 JP2.3
A2+
  Top 0.254: U1.32 47.91,39.78 60.62,39.78 JP2.13
A2-
  Top 0.254: U1.33 47.9,40.23 58.53,40.23 JP2.11
A3+
  Top 0.254: U1.28 46.08,36.4 54.91,36.4 58.55,32.77 58.55,31.83 JP2.21
A3-
  Top 0.254: U1.29 46.38,36.8 56.11,36.8 JP2.19
B1+
  Top 0.254: U1.35 46.56,42.67 55.89,42.67 JP2.7
B1-
  Top 0.254: U1.34 46.86,42.27 58.02,42.27 JP2.9
B2+
  Top 0.254: U1.31 46.85,37.74 58.4,37.74 58.8,37.34 60.66,37.34 JP2.15
B2-
  Top 0.254: U1.30 46.55,37.34 58.12,37.34 JP2.17
B3+
  Top 0.254: U1.27 45.95,35.81 54.1,35.81 57.02,32.89 57.02,30.81 JP2.23
B3-
  Top 0.254: U1.26 45.65,35.41 53.49,35.41 56.01,32.89 56.01,29.29 JP2.25
CLK_N  (via drill 0.3)
  Top 0.152: U3.4 15.42,42.6 14.43,41.6 MCLK.1 | U$1.104 3.79,43.81 6.25,43.81 8.46,41.6 v9.35,41.6
  Bottom 0.152: v9.35,41.6 MCLK.1
CLK_P  (via drill 0.3)
  Top 0.152: U3.3 15.65,45.19 14.15,46.69 MCLK.3 | v9.35,46.69 7.98,46.69 6.37,45.08 U$1.103
  Bottom 0.152: MCLK.3 v9.35,46.69
CX_LRCK
  Top 0.152: J2.3 29.84,77.47 23.37,77.47 20.7,74.8 LRCK.1 24.97,60.98 24.97,41.12 26.32,39.78 30.41,39.78 32.89,37.29 33.4,37.29 U1.3
CX_SCLK
  Top 0.152: J2.1 29.84,72.39 24.13,72.39 23.24,71.5 SCLK.1 23.29,65.2 23.29,64.34 25.27,62.36 25.27,41.25 26.42,40.11 30.5,40.11 32.89,37.72 33.12,37.72 U1.2
CX_SDIN1
  Top 0.152: J2.6 32.39,77.47 31.11,76.2 31.11,70.48 30.48,69.85 27.43,69.85 25.78,68.2 SDIN1.1 25.76,65.23 25.88,65.23 25.88,42.72 27.03,41.58 30.29,41.58 U1.1
CX_SDIN2
  Top 0.152: J2.4 32.39,69.98 31.11,68.71 28.96,68.71 28.32,68.07 SDIN2.1 26.19,63.12 26.19,42.85 27.15,41.88 32.81,41.88 U1.64
CX_SDIN3
  Top 0.152: J2.9 34.93,77.47 33.66,76.2 33.66,68.05 SDIN3.1 26.49,60.88 26.49,43 27.28,42.22 33.19,42.22 U1.63
FILT+
  Top 0.254: U1.18 45.56,29.84 C22.1 C21.1
GND  (via drill 0.3, 0.4, 0.6)
  Top 0.254: C20.2 50.85,47.33
  other vias: 28.3,36.6 32.84,31.88 21.39,35.51 21.41,30.3 22.81,34.34 24.23,34.34 22.83,31.5 24.16,31.5 30.07,31.17 17.78,46.51 15.57,47.75 46.61,65.79 53.59,58.57 34.29,59.77 33.02,62.15 31.45,60.58 36.12,56.92 36.12,54.53 37.13,51.46 36.09,51.46 35.05,51.46 30.07,32.31 45.57,50.72 47.17,50.72 50.83,50.7 53.67,51.92 52.27,50.7 52.45,48.79 51.03,48.79 38.33,31.14 40.39,28.37 40.28,25.91 50.47,26.57 50.47,24.16 52.27,24.16 52.25,26.57 40.87,35.2 37.82,36.73 36.04,38.51 35.28,40.79 38.84,44.35 43.15,42.57 42.9,37.49 44.42,32.41 46.46,31.14 49.76,29.87 52.17,31.39 53.7,31.39 53.7,33.81 52.17,33.81 38.99,28.37 39.01,25.91 37.64,56.92 37.64,54.53 20.98,23.72 16.54,33.38 24.03,39.85 22.25,58.65 25.04,69.95 3.84,10.01 8.03,50.27 8.15,44.3 28.12,44.5 27.84,68.94 32.54,68.81 50.19,70.64 35.33,34.62 28.75,40.87 48.39,70.64 44.12,68.15 46.48,68.15 43.18,70.87 41.94,70.87 40.64,70.87 44.07,65.79 36.88,70.87 35.56,70.87 34.32,70.87 33.5,52.83 38.71,52.83 32.89,59.77 34.29,62.15 16.94,49.12 29.69,37.87 48.36,31.14 53.85,47.4 22.83,29.08 24.16,29.08 24.23,36.75 22.81,36.75 47.09,46.15
  pour Top: -2.79,82.42 81.15,82.42 81.15,-2.29 -2.79,-2.29
  pour Bottom: -2.54,81.92 82.04,81.92 82.04,-1.27 -2.54,-1.27
IN_L+
  Top 0.254: J1.1 42.52,11.76 41.53,12.75 JP3.4
IN_L-
  Top 0.254: J1.3 44.07,4.06 JP3.2
IN_R+
  Top 0.254: J1.6 40.01,2.52 41.22,3.73 41.22,11.3 38.99,13.54 JP3.6
IN_R-
  Top 0.254: J1.4 39.98,10.39 36.45,13.92 JP3.8
INL+
  Top 0.254: 35.69,25.01 C37.2 35.64,23.55 36.45,22.73 39.14,22.73 JP3.3
INL-
  Top 0.254: 37.29,25.35 C36.2 37.29,24.05 37.59,23.75 40.66,23.75 JP3.1
INR+
  Top 0.254: C35.2 34.04,25.01 34.04,22.23 34.42,21.84 37.47,21.84 38.96,20.34 JP3.5
INR-
  Top 0.254: C34.2 32.38,25.01 32.38,21.72 33.78,20.32 36.42,20.32 JP3.7
INT
  Top 0.152: U1.11 35,33.23 35,31.8 30.8,27.6 30.8,19.53 30.25,18.99 30.25,9.7 J1.9
LPFLT
  Top 0.254: 46.36,44.83 | U1.39 45.89,44.83 46.36,44.83 | 46.36,44.83 47.47,44.83 48.21,45.57 49.19,45.57 49.27,45.64 | 49.27,45.64 C20.1 | 49.27,45.64 R1.2
MCLK  (via drill 0.3)
  Top 0.152: v23.11,46.61 22.07,46.61 21.74,46.28 R7.1 21.17,45.3 19.63,43.76 16.15,43.76 15.77,44.15 MCLK.2 | U1.59 32.59,45.64 32.59,46.43 32.41,46.61 v28.47,46.61
  Bottom 0.152: v28.47,46.61 v23.11,46.61
MUTEC
  Top 0.254: U1.38 46.19,44.42 53.57,44.42 54.74,45.59 54.74,52.32 57.4,54.99 60.59,54.99 JP2.1
N$1
  Top 0.152: R12.1 33.99,47.78 U1.54
N$2
  Top 0.152: 42.81,62.87 R11.2 42.77,62.83 U2.5
N$3
  Top 0.254: R1.1 50.8,45.58 C19.1
N$4
  Top 0.152: R13.1 31.75,45.52 33.86,43.41 34.11,43.41 U1.60
N$5
  Top 0.152: U1.61 33.36,43.46 R14.1
N$7
  Top 0.152: U3.5 21.46,42.6 21.74,42.88 R7.2
N$16
  Top 0.254: U1.15 36.5,31.9 36.5,31.11 35.64,30.25 C37.1
N$17
  Top 0.254: U1.16 37.29,31.98 C36.1
N$18
  Top 0.254: U1.14 36.09,32.2 36.09,31.28 33.98,29.17 C35.1
N$19
  Top 0.254: U1.13 35.69,32.51 35.69,31.45 32.33,28.09 C34.1
RMCK
  Top 0.152: U1.55 34.93,46.13 RMCK.1
RP0
  Top 0.152: U1.49 42.04,50.17 42.04,54.94 41.1,55.88 C25.2
RP1
  Top 0.152: U1.48 42.37,47.67 42.37,54.03 42.65,54.3 C26.2
RP2
  Top 0.152: U1.47 42.7,47.29 42.7,53.49 44.22,55.02 C27.2
RP3
  Top 0.152: U1.46 43.03,46.92 43.03,53.39 45.77,56.13 C28.2
RP4
  Top 0.152: 47.09,56.81 C29.2 47.35,56.08 43.36,52.09 43.36,46.54 U1.45
RP5
  Top 0.152: U1.44 43.69,46.16 43.69,51.51 47.93,55.75 48.56,55.75 48.9,56.08 C30.2
RP6
  Top 0.152: U1.43 44.02,45.79 44.02,50.9 48.23,55.12 49.91,55.12 50.47,55.68 C31.2
RP7
  Top 0.152: U1.42 44.35,45.41 44.35,50.8 48.36,54.81 50.95,54.81 52.17,56.03 C32.2
RST_N
  Top 0.152: U1.12 35.31,32.83 35.31,31.68 31.1,27.47 R10.1 31.1,13.93 J1.7
RXP0
  Top 0.152: J2.13 40.01,70.46 40.64,69.83 40.64,60.1 41.1,59.64 C25.1
RXP1
  Top 0.152: J2.18 41.27,76.21 41.27,61.62 41.81,61.09 R11.1 42.72,58.63 C26.1
RXP1_N
  Top 0.152: U2.4 42.77,69.44 43.81,70.48 43.81,76.21 J2.21
RXP1_P
  Top 0.152: U2.3 45.36,69.49 45.09,69.77 J2.19
RXP2
  Top 0.152: J2.16 42.55,70.48 41.6,69.55 41.6,62.23 41.86,61.98 43.69,61.98 44.22,61.44 C27.1
RXP3
  Top 0.152: J2.22 47.63,69.97 49.53,68.07 49.53,63.5 45.77,59.74 C28.1
RXP4
  Top 0.152: J2.24 47.63,77.47 49.17,75.92 49.17,69.72 50.29,68.61 50.29,62.48 47.35,59.54 C29.1
RXP5
  Top 0.152: J2.25 51.31,71.27 51.31,62.1 48.9,59.69 C30.1
RXP6
  Top 0.152: J2.27 52.7,74.95 52.7,61.98 50.47,59.74 C31.1
SAI_LRCK
  Top 0.152: J2.12 37.47,77.47 36.2,76.2 36.2,67.69 27.46,58.95 27.46,46.31 28.25,45.52 R13.2
SAI_SCLK
  Top 0.152: J2.7 34.93,67.47 27.15,59.69 27.15,43.76 27.46,43.46 R14.2
SAI_SDOUT
  Top 0.152: J2.10 37.47,67.97 28.09,58.6 28.09,48.16 28.47,47.78 R12.2
SCL  (via drill 0.3)
  Top 0.152: R4.1 15.4,59.69 16.87,59.69 17.04,59.87 JP1.1 23.44,59.87 24.36,58.95 24.36,42.57 21.16,39.37 v19.81,39.37 | U1.7 34.39,35.45 34.39,32.05 28.88,26.54 v19.81,26.54 | v19.81,36.83 v19.81,29.08
  Top 0.254: R8.2 R3.1 R4.1
  Bottom 0.152: v19.81,39.37 v19.81,36.83 | v19.81,29.08 v19.81,26.54
SCL0
  Top 0.152: U$1.116 3.79,61.57 12.52,61.57 12.7,61.75 R3.2
SCL1
  Top 0.152: U$1.114 3.81,59.05 12.17,59.05 12.83,59.72 R4.2
SDA  (via drill 0.3)
  Top 0.152: R5.1 15.48,57.58 16.79,57.58 17.04,57.33 JP1.2 22.99,57.33 24.05,56.26 24.05,42.72 21.34,40.01 18.8,40.01 v18.16,39.37 | U1.8 34.7,35.05 34.7,31.93 28.42,25.65 18.54,25.65 18.16,26.04 v18.16,26.54 | v18.16,29.08 v18.16,36.83
  Top 0.254: R5.1 R6.1 R9.1
  Bottom 0.152: v18.16,26.54 v18.16,29.08 | v18.16,36.83 v18.16,39.37
SDA0
  Top 0.152: R5.2 14.38,57.68 14.48,57.78 14.48,60.29 14.27,60.49 13,60.49 11.86,59.36 6.03,59.36 U$1.115
SDA1
  Top 0.152: U$1.113 7.19,55.65 R6.2
TP0
  Top 0.152: U1.50 37.72,46.88 37.72,47.24 38.1,47.62 38.73,47.62 41.25,50.14 R2.2
TXP0
  Top 0.152: J2.15 38.73,76.21 38.73,70.36 40.01,69.09 40.01,55.75 41.25,54.51 R2.1
VQ
  Top 0.254: U1.17 41.41,31.14 C23.1 41.44,28.74 C24.1

### Text on the board
tPlace: CX_LRC | CX_SD1 | CX_SD3 | SI_LRC | TXP0 | RXP1 | RXP1_N | RXP4 | RXP6 | CX_SCK | CX_SD2 | SI_SCK | SI_OUT | RXP0 | RXP2 | RXP1_P | RXP3 | RXP5
tNames: 25 | GND | GND | SCL | SDA | MUTEC | A1- | A1+ | B1+ | MTC | B1- | A1+ | A1- | A2- | B1+ | B1- | A2+ | A2+ | A2- | B2+ | B2+ | B2- | B2- | A3+ | A3- | A3- | B3+ | B3- | A3+ | B3+ | B3- | R- | R+ | L+ | L- | RST_N | IR- | IL+ | INT | IR+ | IL- | GND | GND | GND | 17.05.10.A